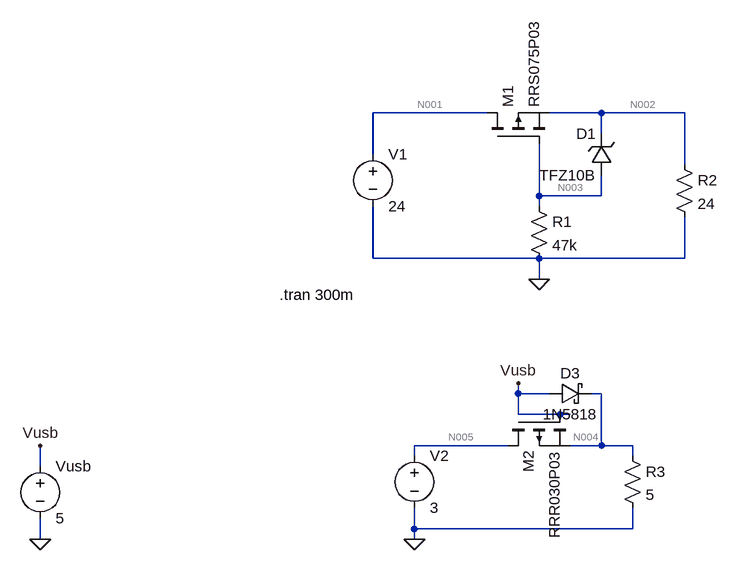
[diagram p0: schematic reverse-polarity.asc]
reverse-polarity.asc, the LTspice schematic file:
Version 4
SHEET 1 880 724
WIRE 272 48 96 48
WIRE 448 48 368 48
WIRE 576 48 448 48
WIRE 448 80 448 48
WIRE 96 112 96 48
WIRE 576 128 576 48
WIRE 352 176 352 96
WIRE 448 176 448 144
WIRE 448 176 352 176
WIRE 352 192 352 176
WIRE 96 272 96 192
WIRE 352 272 96 272
WIRE 576 272 576 208
WIRE 576 272 352 272
WIRE 352 304 352 272
WIRE 320 480 320 464
WIRE 368 480 320 480
WIRE 448 480 432 480
WIRE 320 512 320 480
WIRE 384 512 320 512
WIRE 400 512 384 512
WIRE 304 560 160 560
WIRE 448 560 448 480
WIRE 448 560 400 560
WIRE 496 560 448 560
WIRE 160 576 160 560
WIRE 496 576 496 560
WIRE -416 592 -416 560
WIRE 160 688 160 656
WIRE 496 688 496 656
WIRE 496 688 160 688
WIRE -416 704 -416 672
WIRE 160 704 160 688
FLAG 352 304 0
FLAG -416 560 Vusb
FLAG -416 704 0
FLAG 320 464 Vusb
FLAG 160 704 0
SYMBOL voltage 96 96 R0
WINDOW 123 0 0 Left 0
WINDOW 39 0 0 Left 0
SYMATTR InstName V1
SYMATTR Value 24
SYMBOL pmos 272 96 R270
SYMATTR InstName M1
SYMATTR Value RRS075P03
SYMBOL zener 464 144 R180
WINDOW 0 24 64 Left 2
WINDOW 3 24 0 Left 2
SYMATTR InstName D1
SYMATTR Value TFZ10B
SYMBOL res 336 176 R0
SYMATTR InstName R1
SYMATTR Value 47k
SYMBOL res 560 112 R0
SYMATTR InstName R2
SYMATTR Value 24
SYMBOL voltage 160 560 R0
WINDOW 123 0 0 Left 0
WINDOW 39 0 0 Left 0
SYMATTR InstName V2
SYMATTR Value 3
SYMBOL pmos 304 512 M90
SYMATTR InstName M2
SYMATTR Value RRR030P03
SYMBOL voltage -416 576 R0
WINDOW 123 0 0 Left 0
WINDOW 39 0 0 Left 0
SYMATTR InstName Vusb
SYMATTR Value 5
SYMBOL res 480 560 R0
SYMATTR InstName R3
SYMATTR Value 5
SYMBOL schottky 368 496 R270
WINDOW 0 32 32 VTop 2
WINDOW 3 0 32 VBottom 2
SYMATTR InstName D3
SYMATTR Value 1N5818
SYMATTR Description Diode
SYMATTR Type diode
TEXT -48 328 Left 2 !.tran 300m

The netlist it stands for:
* reverse-polarity.asc
V1 N001 0 24
M1 N001 N003 N002 N002 RRS075P03
D1 N003 N002 TFZ10B
R1 N003 0 47k
R2 N002 0 24
V2 N005 0 3
M2 N005 Vusb N004 N004 RRR030P03
Vusb Vusb 0 5
R3 N004 0 5
D3 Vusb N004 1N5818
.model D D
.lib standard.dio
.model NMOS NMOS
.model PMOS PMOS
.lib standard.mos
.tran 300m
.backanno
.end

* Results of the author's LTspice run, read from the files saved beside the schematic
* Operating Point, zero values left out:
*   V(n001) = 24 V
*   V(n003) = 14.35 V
*   V(n002) = 23.98 V
*   V(n005) = 3 V
*   V(vusb) = 5 V
*   V(n004) = 4.588 V
*   Id(M2) = -43.07 pA
*   Is(M2) = 43.07 pA
*   Id(M1) = 999.7 mA
*   Is(M1) = -999.7 mA
*   I(D3) = 917.7 mA
*   I(D1) = -305.2 µA
*   I(R3) = 917.7 mA
*   I(R2) = 999.4 mA
*   I(R1) = 305.2 µA
*   I(Vusb) = -917.7 mA
*   I(V2) = 44.64 pA
*   I(V1) = -999.7 mA